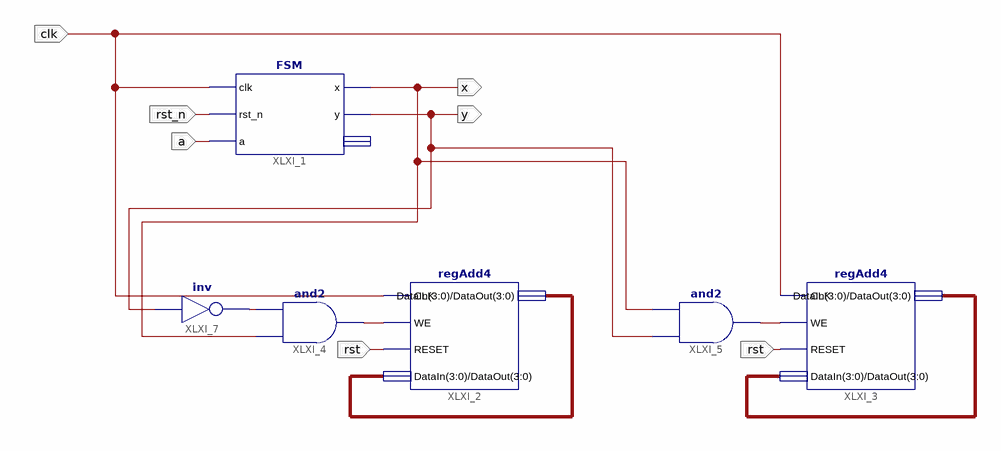
[diagram p0: schematic sheet 1]
// Xilinx ISE schematic Aufgabe1f.sch (spartan3e) as structural Verilog: 6 symbols, 6 ports
module Aufgabe1f (
  input  rst_n,
  input  a,
  input  clk,
  input  rst,
  output x,
  output y
);

  wire XLXN_20, XLXN_22, XLXN_24;
  wire [3:0] XLXN_34, XLXN_35;

  FSM XLXI_1 (.clk(clk), .rst_n(rst_n), .a(a), .x(x), .y(y));  // open: debug_state
  regAdd4 XLXI_2 (.CLK(clk), .WE(XLXN_22), .RESET(rst), .DataIn(XLXN_34), .DataOut(XLXN_34));
  regAdd4 XLXI_3 (.CLK(clk), .WE(XLXN_20), .RESET(rst), .DataIn(XLXN_35), .DataOut(XLXN_35));
  and XLXI_4 (XLXN_22, x, XLXN_24);
  and XLXI_5 (XLXN_20, y, x);
  not XLXI_7 (XLXN_24, y);
endmodule
